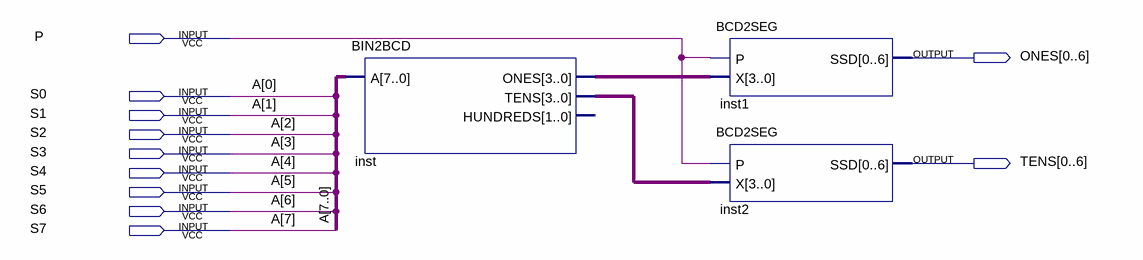
[diagram p0: schematic sheet]
// Quartus schematic BIN2SEG.bdf as structural Verilog: 3 symbols, 11 pins
module BIN2SEG (
  input  P,
  input  S0,
  input  S1,
  input  S2,
  input  S3,
  input  S4,
  input  S5,
  input  S6,
  input  S7,
  output [0:6] ONES,
  output [0:6] TENS
);

  wire [3:0] inst_ones, inst_tens;

  BIN2BCD inst (.A({S7, S6, S5, S4, S3, S2, S1, S0}), .ONES(inst_ones), .TENS(inst_tens));  // open: HUNDREDS
  BCD2SEG inst1 (.P(P), .X(inst_ones), .SSD(ONES));
  BCD2SEG inst2 (.P(P), .X(inst_tens), .SSD(TENS));

  // Other names for the same wires on the sheet: A[7:0] = {S7, S6, S5, S4, S3, S2, S1, S0}
endmodule
